# EAGLE design water ver4.00 (EAGLE 9.6.2)
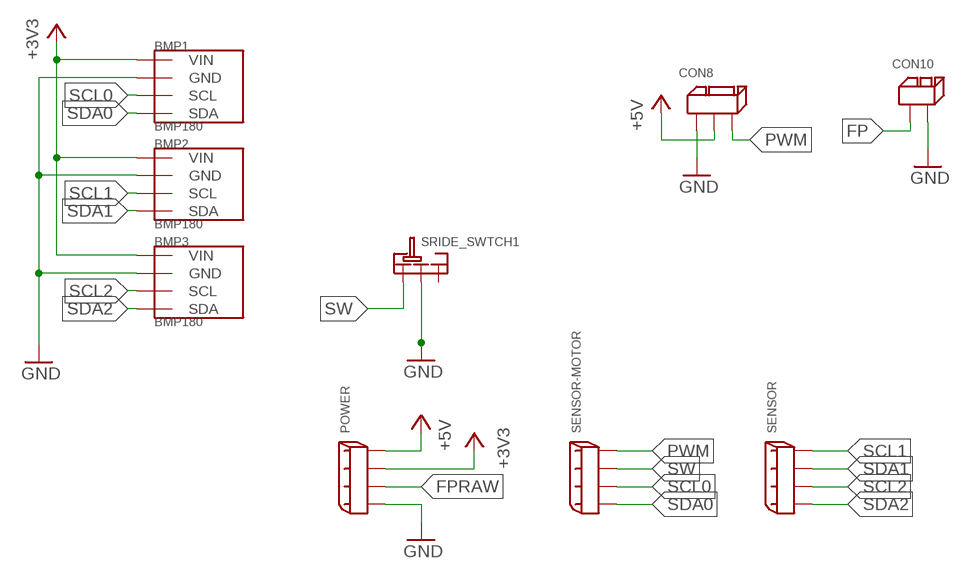
[diagram p0: schematic, sheet 1]

## Parts
BMP1  BMP180  [GY-68]
BMP2  BMP180  [GY-68]
BMP3  BMP180  [GY-68]
CON8  3PIN  [3PIN]
CON10  2PIN  [2PIN]
POWER  2.5_MINI-SPOX_4PIN  [2.5_MINI-SPOX_4PIN]
SENSOR  2.5_MINI-SPOX_4PIN  [2.5_MINI-SPOX_4PIN]
SENSOR-MOTOR  2.5_MINI-SPOX_4PIN  [2.5_MINI-SPOX_4PIN]
SRIDE_SWTCH1  SRIDE_SWITCH  [SRIDE_SWITCH]

## Nets
+3V3: BMP1.P1(VIN) BMP2.P1(VIN) BMP3.P1(VIN) POWER.P$3
+5V: CON8.P$2 POWER.P$4
FP: CON10.P$1
FPRAW: POWER.P$2
GND: BMP1.P2(GND) BMP2.P2(GND) BMP3.P2(GND) CON8.P$1 CON10.P$2 POWER.P$1 SRIDE_SWTCH1.LR
PWM: CON8.P$3 SENSOR-MOTOR.P$4
SCL0: BMP1.P3(SCL) SENSOR-MOTOR.P$2
SCL1: BMP2.P3(SCL) SENSOR.P$4
SCL2: BMP3.P3(SCL) SENSOR.P$2
SDA0: BMP1.P4(SDA) SENSOR-MOTOR.P$1
SDA1: BMP2.P4(SDA) SENSOR.P$3
SDA2: BMP3.P4(SDA) SENSOR.P$1
SW: SENSOR-MOTOR.P$3 SRIDE_SWTCH1.L
Unconnected: SRIDE_SWTCH1.R

## Library data of the parts
BMP1-BMP3 = BMP180:BMP180
CON8 = XR Connector:3PIN
CON10 = XR Connector:2PIN
POWER SENSOR SENSOR-MOTOR = Connector:2.5_MINI-SPOX_4PIN
SRIDE_SWTCH1 = Sride Switch:SRIDE_SWITCH

## Net classes
0 default: width 0.635 mm

## Board
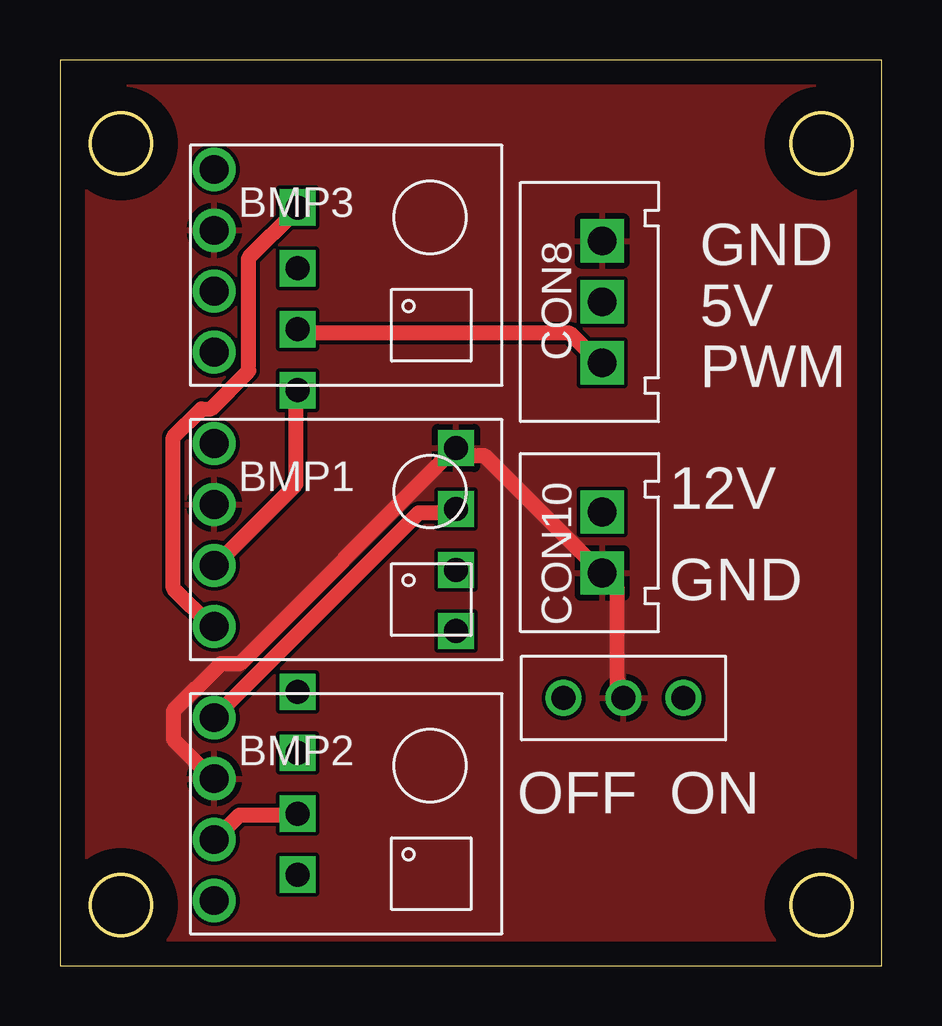
[diagram p1: board, top side]
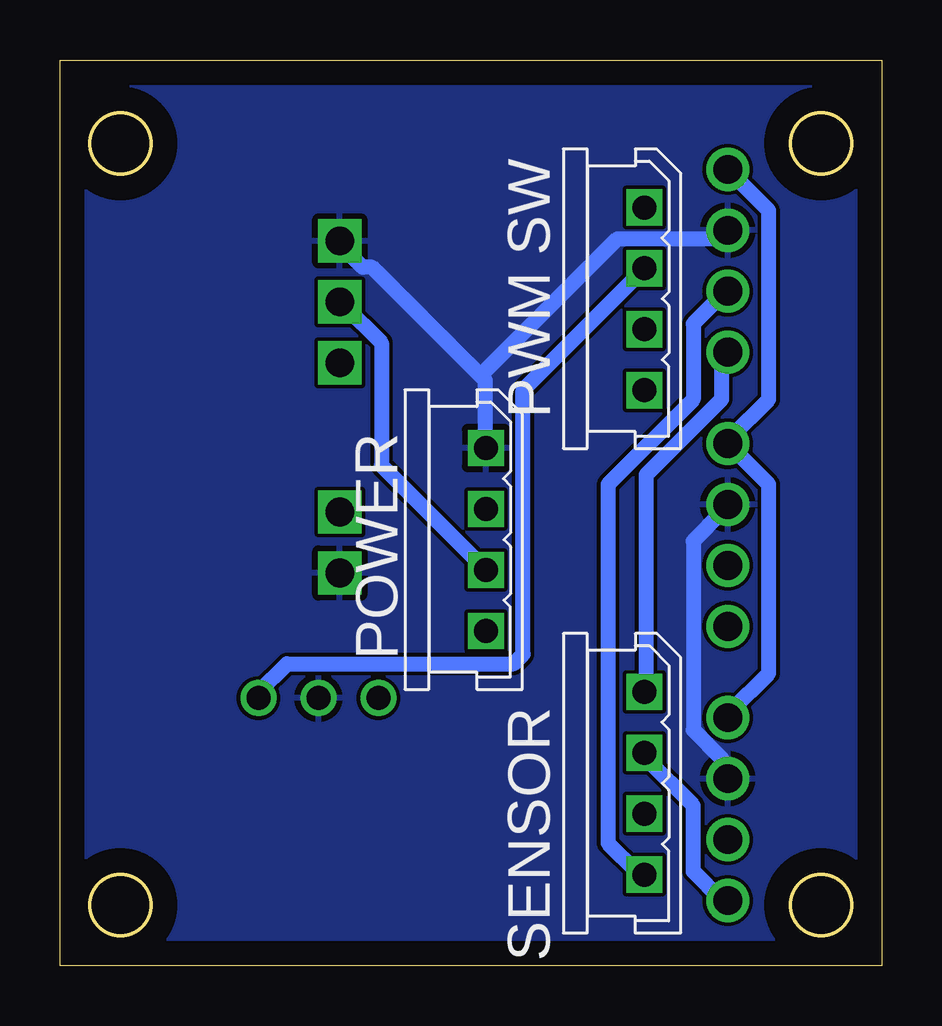
[diagram p2: board, bottom side, seen from below]

Size 34.27 x 37.77 mm. Coordinates in mm from the lower left corner, seen from the top.
Outline: 0,0 34.27,0 34.27,37.77 0,37.77 0,0
Outline: circle at 2.54,34.29 radius 1.27
Outline: circle at 2.54,2.54 radius 1.27
Outline: circle at 31.75,2.54 radius 1.27
Outline: circle at 31.75,34.29 radius 1.27
Copper layers (1*16): Top 0.035mm / dielectric 1.5mm / Bottom 0.035mm
Design rules "default *": minimum track width 16mil, minimum drill 0.35mm, track to track 6mil, track to pad 6mil, pad to pad 6mil, via to via 6mil, smd to smd 6mil, copper to edge 40mil, drill to drill 6mil, minimum pad ring 10mil, minimum via ring 8mil, stop-mask expansion 4mil, vias tented up to drill 0mil, thermal gap 10mil

### Footprints (pad centres in the part's own frame; a part is rotated, then mirrored left to right if it is on the bottom)
GY-68 = drill 1.2: P1 -5,4; P2 -5,1.46; P3 -5,-1.08; P4 -5,-3.62
3PIN = drill 1.2 square: P$1 2.54,-2.54; P$2 5.08,-2.54; P$3 7.62,-2.54
2PIN = drill 1.2 square: P$1 -1.27,0; P$2 1.27,0
2.5_MINI-SPOX_4PIN = drill 1 square: P$1 -1.27,0; P$2 6.35,0; P$3 1.27,0; P$4 3.81,0
SRIDE_SWITCH = drill 1: L -2.5,0; LR 0,0; R 2.5,0

### Placement (x,y rotation side)
BMP1  11.43,17.78 0 top
BMP2  11.43,6.35 0 top
BMP3  11.43,29.21 0 top
CON8  25.15,32.77 270 top
CON10  22.61,17.65 270 top
POWER  16.51,20.32 270 bottom
SENSOR  9.91,10.16 270 bottom
SENSOR-MOTOR  9.91,30.35 270 bottom
SRIDE_SWTCH1  23.5,11.18 180 top

### Tracks (layer width: path | path; a pad name or v marks a point on that pad's centre or on a via)
+3V3
  Top 0.635: POWER.P$3 16.14,18.9 14.96,18.9 6.69,10.63 BMP2.P1
  Bottom 0.635: BMP2.P1 6.3,10.63 4.72,12.21 4.72,20.08 6.3,21.65 BMP1.P1 6.3,22.05 4.72,23.62 4.72,31.5 6.3,33.07 BMP3.P1
+5V
  Bottom 0.635: POWER.P$4 20.87,20.87 20.87,25.98 22.44,27.56 CON8.P$2
GND
  Top 0.635: SRIDE_SWTCH1.LR 23.23,11.42 23.23,15.75 22.84,16.14 CON10.P$2 22.44,16.54 17.72,21.26 16.54,21.26 POWER.P$1 16.14,21.26 7.48,12.6 6.69,12.6 4.72,10.63 4.72,9.45 6.3,7.87 BMP2.P2
  Bottom 0.635: BMP2.P2 6.69,7.87 6.69,8.66 7.87,9.84 7.87,17.72 6.69,18.9 BMP1.P2 | 16.73,24.61 16.54,24.41 16.54,21.65 POWER.P$1 | 16.73,24.61 21.26,29.13 21.65,29.13 22.44,29.92 CON8.P$1 | 16.73,24.61 11.02,30.32 6.69,30.32 BMP3.P2
  pour Top: -2.54,39.37 36.83,39.37 36.83,-2.54 -2.54,-2.54
  pour Bottom: -3.81,40.64 38.1,40.64 38.1,-3.81 -3.81,-3.81
PWM
  Top 0.635: SENSOR-MOTOR.P$4 10.24,26.38 21.26,26.38 22.44,25.2 CON8.P$3
SCL0
  Top 0.635: SENSOR-MOTOR.P$2 9.84,23.62 9.84,20.08 6.69,16.93 BMP1.P3
SCL1
  Top 0.635: SENSOR.P$4 9.84,6.3 7.48,6.3 6.69,5.51 BMP2.P3
SCL2
  Bottom 0.635: SENSOR.P$2 10.24,3.94 11.42,5.12 11.42,20.08 7.87,23.62 7.87,26.77 6.69,27.95 BMP3.P3
SDA0
  Top 0.635: SENSOR-MOTOR.P$1 9.84,31.5 7.87,29.53 7.87,24.8 6.3,23.23 5.91,23.23 4.72,22.05 4.72,15.75 6.3,14.17 BMP1.P4
SDA1
  Bottom 0.635: SENSOR.P$3 9.84,8.66 7.87,6.69 7.87,3.94 6.69,2.76 BMP2.P4
SDA2
  Bottom 0.635: SENSOR.P$1 9.84,11.81 9.84,20.47 6.69,23.62 6.69,25.2 BMP3.P4
SW
  Bottom 0.635: SENSOR-MOTOR.P$3 10.24,28.74 14.96,24.02 14.96,12.99 15.35,12.6 24.8,12.6 25.98,11.42 SRIDE_SWTCH1.L

### Text on the board
tPlace: GND | 5V | PWM | 12V | GND | OFF | ON
bPlace: PWM SW | POWER | SENSOR